# EAGLE schematic spi-fatfs-template (EAGLE 9.5.2)
CNAME: SPI/FatFS/MicroSD Template; CREVISION: 1.0; DESIGNER: Alligator Descartes
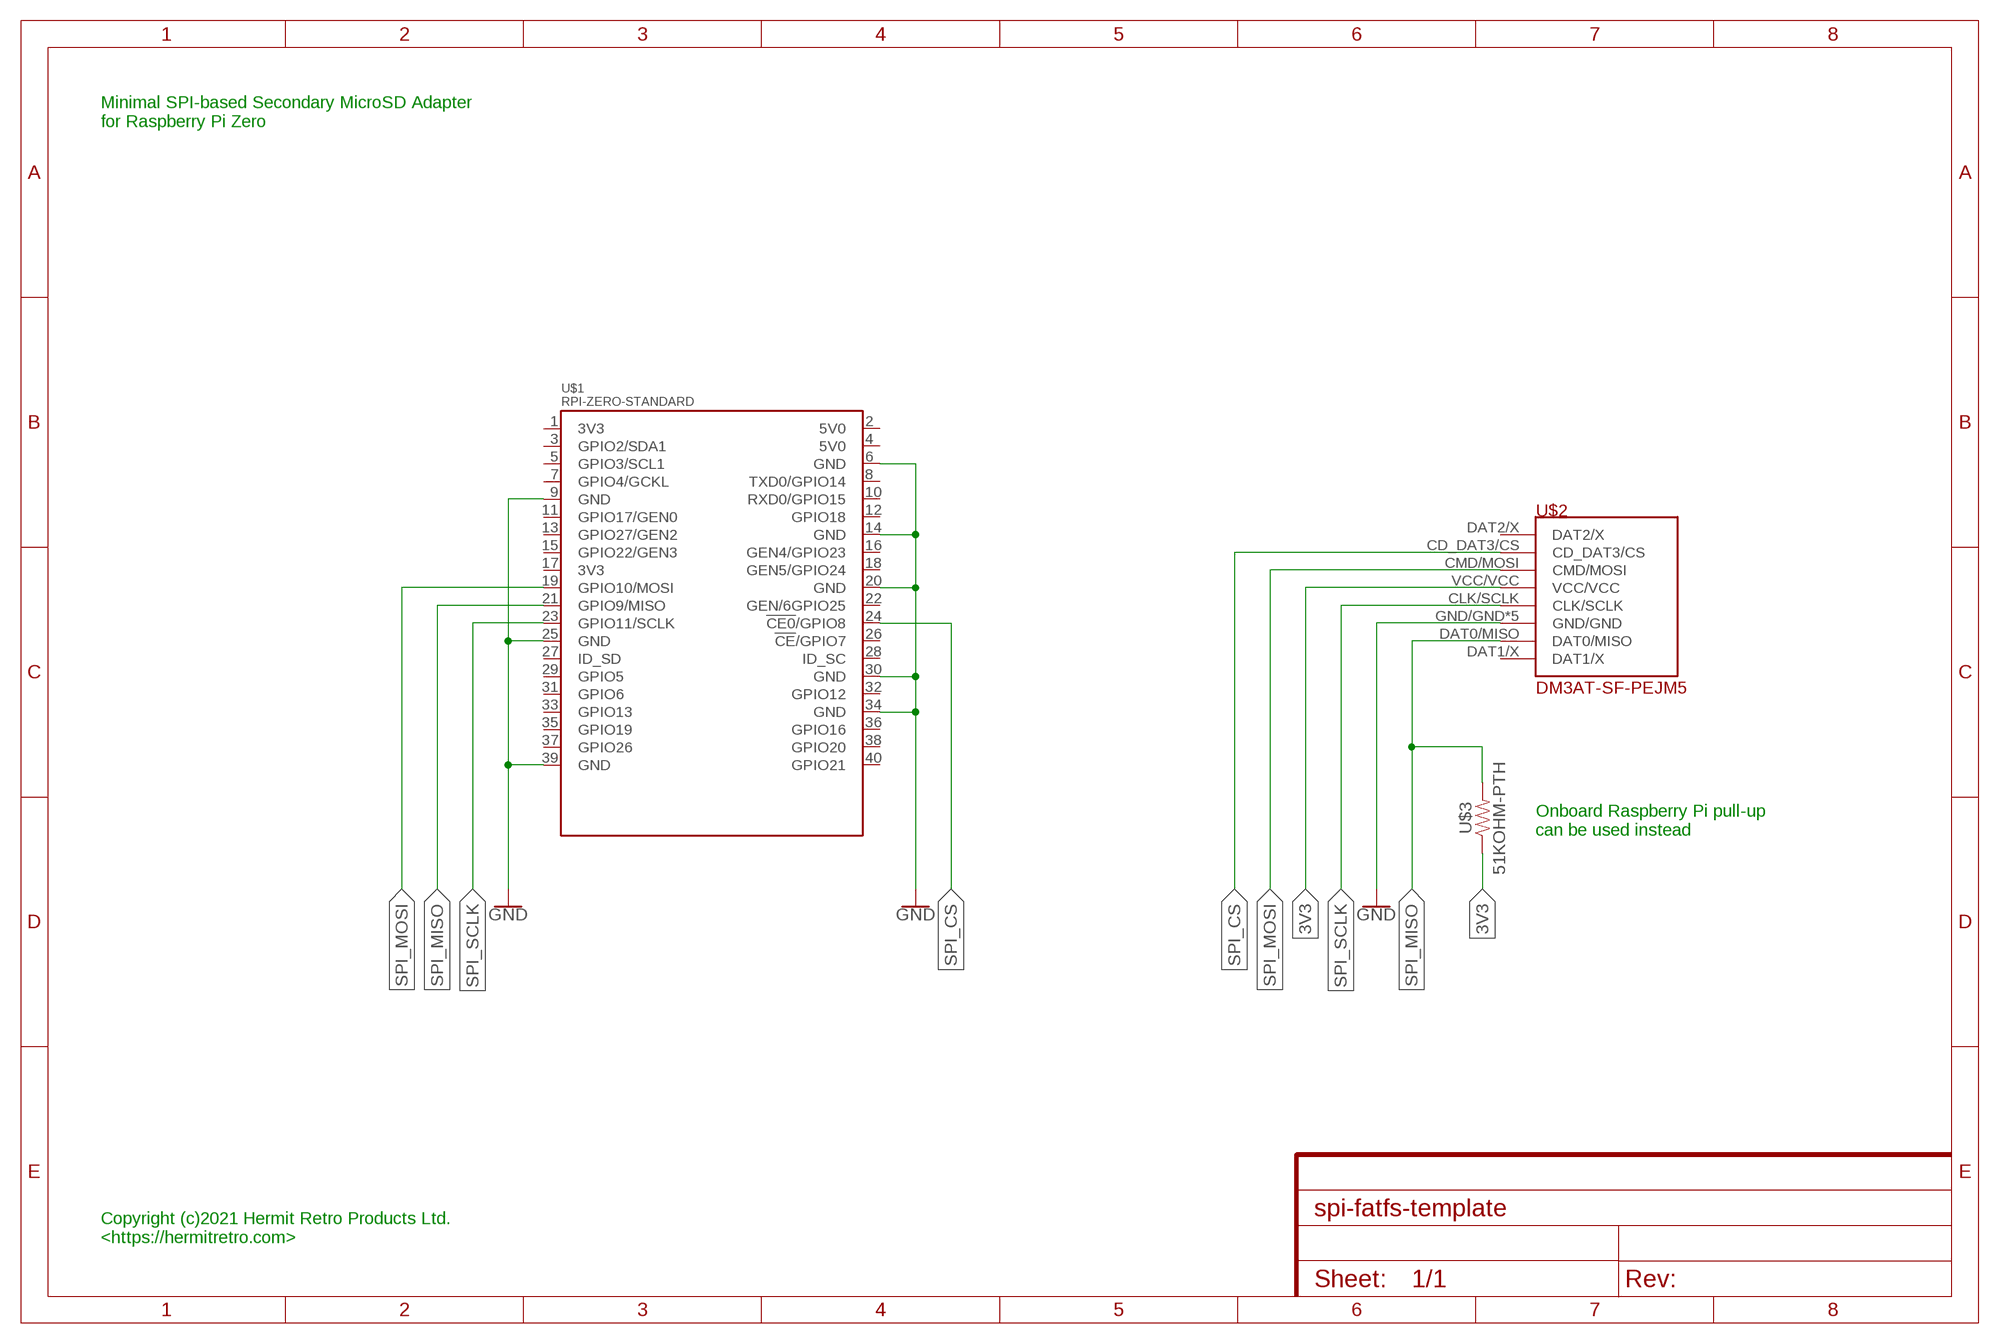
[diagram p0: schematic, sheet 1]

## Parts
U$1  RPI-ZERO-STANDARD  [RASPBERRYPI_BASTELSTUBE_V13_RASPI_BOARD_B+_FULL-HANDHELD]
U$2  DM3AT-SF-PEJM5  [DM3AT-SF-PEJM5]
U$3  51KOHM-PTH  [AXIAL-0.3]

## Nets
3V3: U$2.VCC/VCC U$3.P$1
GND: U$1.6(GND) U$1.9(GND) U$1.14(GND) U$1.20(GND) U$1.25(GND) U$1.30(GND) U$1.34(GND) U$1.39(GND) U$2.GND/GND U$2.GNDBL(GND/GND) U$2.GNDBR(GND/GND) U$2.GNDTL(GND/GND) U$2.GNDTR(GND/GND)
SPI_CS: U$1.24(!CE0!/GPIO8) U$2.CD_DAT3/CS
SPI_MISO: U$1.21(GPIO9/MISO) U$2.DAT0/MISO U$3.P$2
SPI_MOSI: U$1.19(GPIO10/MOSI) U$2.CMD/MOSI
SPI_SCLK: U$1.23(GPIO11/SCLK) U$2.CLK/SCLK
Unconnected: U$1.1(3V3) U$1.2(5V0) U$1.3(GPIO2/SDA1) U$1.4(5V0) U$1.5(GPIO3/SCL1) U$1.7(GPIO4/GCKL) U$1.8(TXD0/GPIO14) U$1.10(RXD0/GPIO15) U$1.11(GPIO17/GEN0) U$1.12(GPIO18) U$1.13(GPIO27/GEN2) U$1.15(GPIO22/GEN3) U$1.16(GEN4/GPIO23) U$1.17(3V3) U$1.18(GEN5/GPIO24) U$1.22(GEN/6GPIO25) U$1.26(!CE!/GPIO7) U$1.27(ID_SD) U$1.28(ID_SC) U$1.29(GPIO5) U$1.31(GPIO6) U$1.32(GPIO12) U$1.33(GPIO13) U$1.35(GPIO19) U$1.36(GPIO16) U$1.37(GPIO26) U$1.38(GPIO20) U$1.40(GPIO21) U$2.DAT1/X U$2.DAT2/X

## Notes on the sheet
- Minimal SPI-based Secondary MicroSD Adapter
  for Raspberry Pi Zero
- Onboard Raspberry Pi pull-up
  can be used instead
- Copyright (c)2021 Hermit Retro Products Ltd.
  <https://hermitretro.com>

## Library data of the parts
U$1 = HermitRetro:RPI-ZERO: Prices include 2x40 header strip RS: 163-5307 Price: 0.77; UNIT_PRICE: 10.37; VENDOR_ID: Pimoroni; VENDOR_SKU: RPI-019
U$2 = HermitRetro:DM3AT-SF-PEJM5: Hirose DM3AT-SF-PEJM5 MicroSD Push-Push Adapter; UNIT_PRICE: 1.66; VENDOR_ID: RS Components; VENDOR_SKU: 828-1884
U$3 = HermitRetro:51KOHM; UNIT_PRICE: 0.13; VENDOR_ID: RS Components; VENDOR_SKU: 148-900